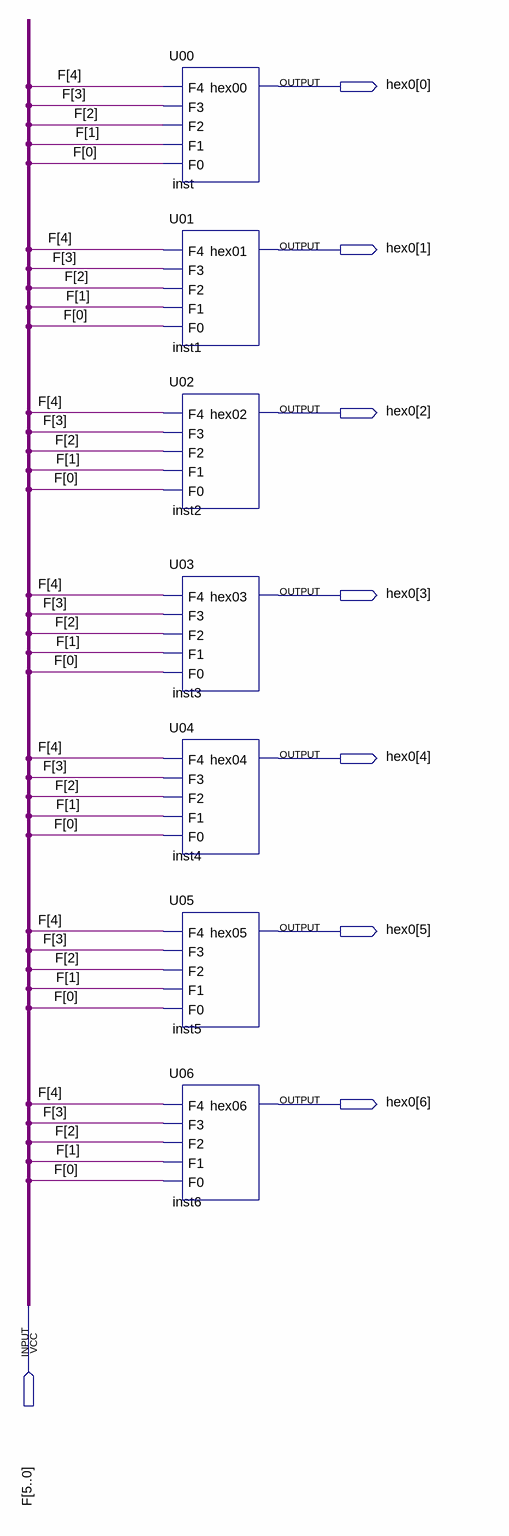
[diagram p0: schematic sheet]
// Quartus schematic Display_7_segmentos_F.bdf as structural Verilog: 7 symbols, 8 pins
module Display_7_segmentos_F (
  input  [5:0] F,
  output [6:0] hex0
);

  U00 inst (.F4(F[4]), .F3(F[3]), .F2(F[2]), .F1(F[1]), .F0(F[0]), .hex00(hex0[0]));
  U01 inst1 (.F4(F[4]), .F3(F[3]), .F2(F[2]), .F1(F[1]), .F0(F[0]), .hex01(hex0[1]));
  U02 inst2 (.F4(F[4]), .F3(F[3]), .F2(F[2]), .F1(F[1]), .F0(F[0]), .hex02(hex0[2]));
  U03 inst3 (.F4(F[4]), .F3(F[3]), .F2(F[2]), .F1(F[1]), .F0(F[0]), .hex03(hex0[3]));
  U04 inst4 (.F4(F[4]), .F3(F[3]), .F2(F[2]), .F1(F[1]), .F0(F[0]), .hex04(hex0[4]));
  U05 inst5 (.F4(F[4]), .F3(F[3]), .F2(F[2]), .F1(F[1]), .F0(F[0]), .hex05(hex0[5]));
  U06 inst6 (.F4(F[4]), .F3(F[3]), .F2(F[2]), .F1(F[1]), .F0(F[0]), .hex06(hex0[6]));
endmodule
